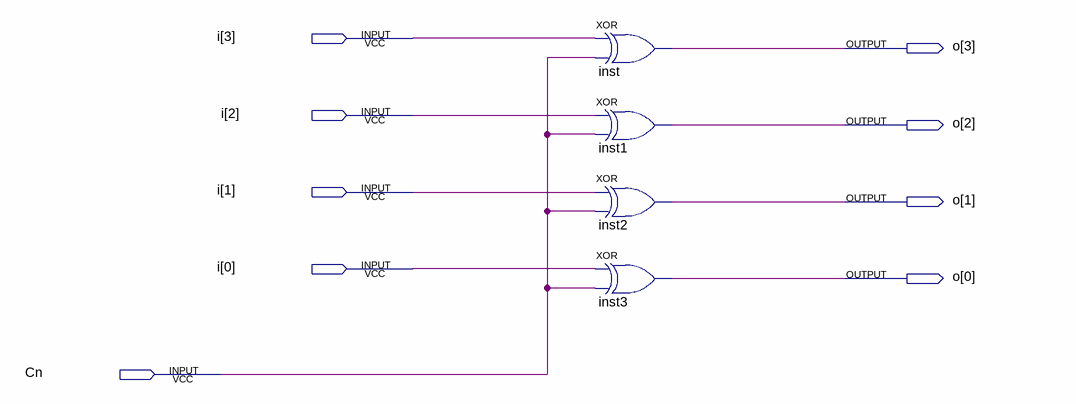
[diagram p0: schematic sheet]
// Quartus schematic Complemento.bdf as structural Verilog: 4 symbols, 9 pins
module Complemento (
  input  [3:0] i,
  input  Cn,
  output [3:0] o
);

  xor inst (o[3], i[3], Cn);
  xor inst1 (o[2], i[2], Cn);
  xor inst2 (o[1], i[1], Cn);
  xor inst3 (o[0], i[0], Cn);
endmodule
